# Altium schematic sheet Title.SchDoc: TITLE
size 420 x 297 mm; Address1: CryptUS; Address3: Pascal-Emmanuel Lachance; Address4: Benjamin Gélinas; SheetNumber: 1; SheetTotal: 12
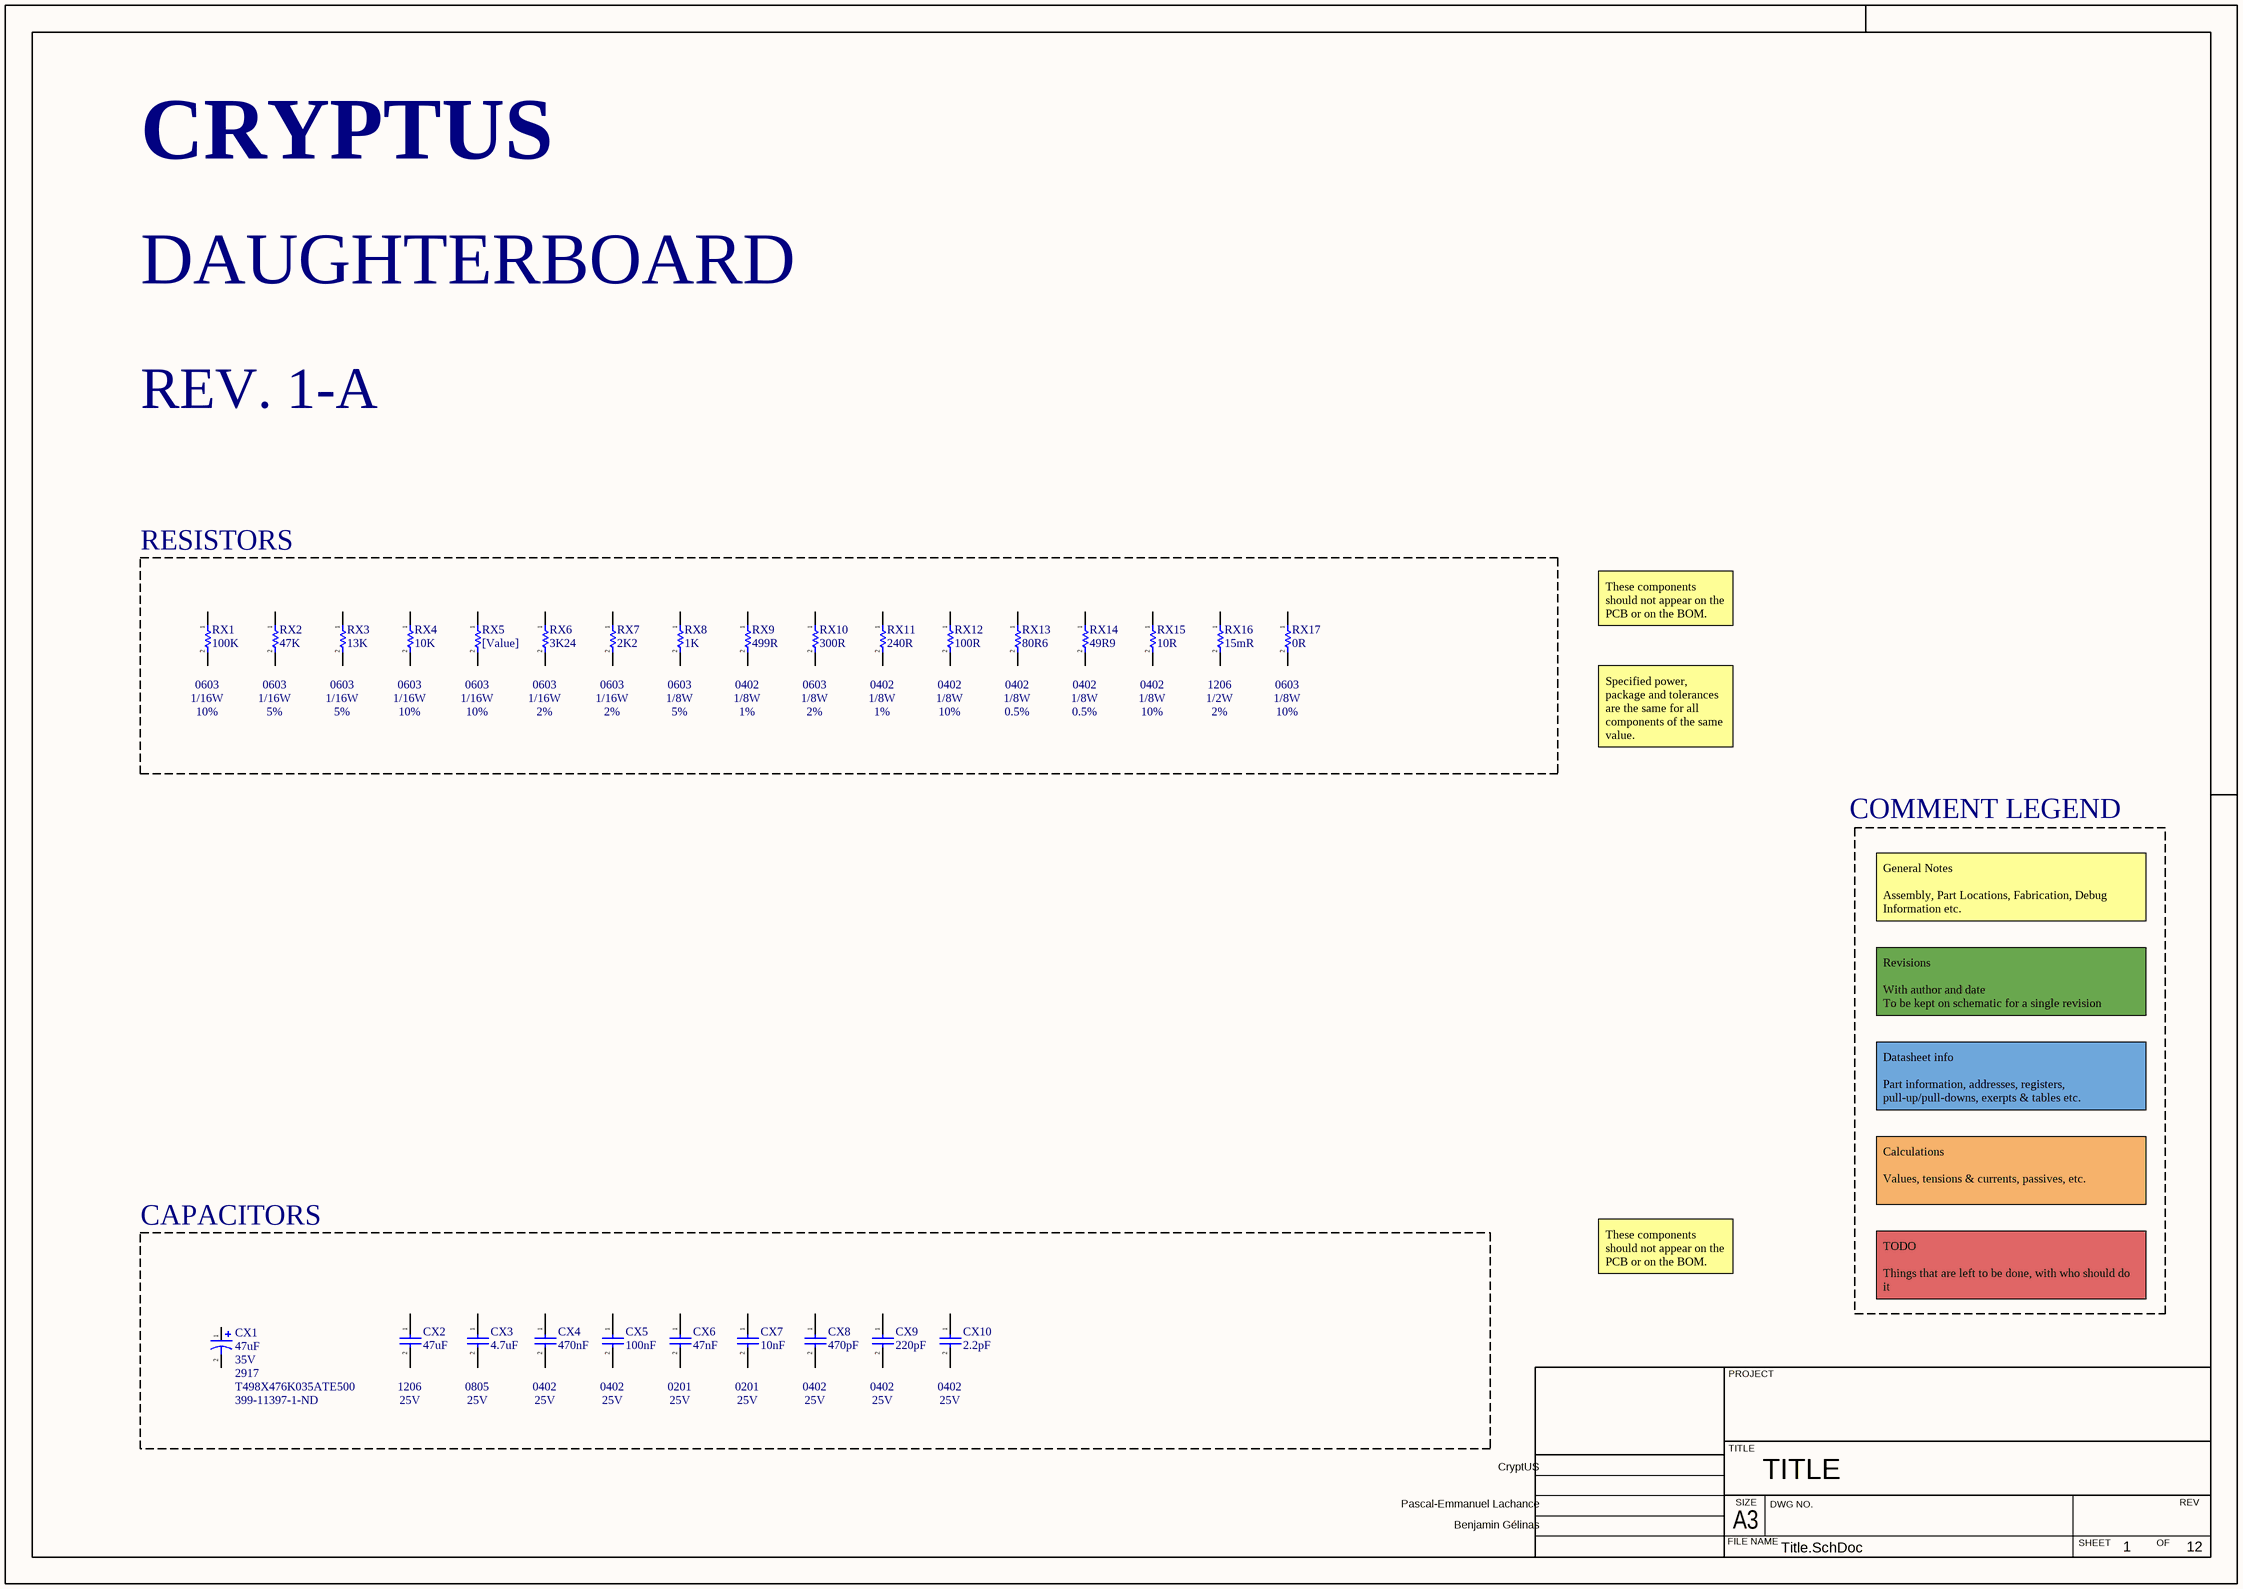
[diagram p0: Title.SchDoc]

## Parts
CX1  47uF  Part #: T498X476K035ATE500  Rated Voltage: 35V  Supplier Part Number 1: 399-11397-1-ND  Package: 2917  [CAP_2917_P]
CX2  47uF  [CAP_1206]
CX3  4.7uF  [CAP_0805]
CX4  470nF  [CAP_0402]
CX5  100nF  [CAP_0402]
CX6  47nF  [CAP_0201]
CX7  10nF  [CAP_0201]
CX8  470pF  [CAP_0402]
CX9  220pF  [CAP_0402]
CX10  2.2pF  [CAP_0402]
RX1  100K  [RES_0603]
RX2  47K  [RES_0603]
RX3  13K  [RES_0603]
RX4  10K  [RES_0603]
RX5  [Value]  [RES_0603]
RX6  3K24  [RES_0603]
RX7  2K2  [RES_0603]
RX8  1K  [RES_0603]
RX9  499R  [RES_0402]
RX10  300R  [RES_0603]
RX11  240R  [RES_0402]
RX12  100R  [RES_0402]
RX13  80R6  [RES_0402]
RX14  49R9  [RES_0402]
RX15  10R  [RES_0402]
RX16  15mR  [RES_1206]
RX17  0R  [RES_0603]

## Blocks framed on the sheet
RESISTORS: RX1-RX17
CAPACITORS: CX1-CX10

## Nets

Not connected (* = marked no-connect by the designer): CX1 1 2; CX2 1 2; CX3 1 2; CX4 1 2; CX5 1 2; CX6 1 2; CX7 1 2; CX8 1 2; CX9 1 2; CX10 1 2; RX1 1 2; RX2 1 2; RX3 1 2; RX4 1 2; RX5 1 2; RX6 1 2; RX7 1 2; RX8 1 2; RX9 1 2; RX10 1 2; RX11 1 2; RX12 1 2; RX13 1 2; RX14 1 2; RX15 1 2; RX16 1 2; RX17 1 2

## Notes on the sheet
- CRYPTUS
- DAUGHTERBOARD
- REV. 1-A
- These components should not appear on the PCB or on the BOM.
- (near RX1) 0603
- (near RX1) 1/16W
- 10%
- (near RX2) 0603
- (near RX2) 1/16W
- 5%
- (near RX3) 0603
- (near RX3) 1/16W
- (near RX4) 0603
- (near RX4) 1/16W
- (near RX5) 0603
- (near RX5) 1/16W
- (near RX6) 0603
- (near RX6) 1/16W
- 2%
- (near RX7) 0603
- (near RX7) 1/16W
- (near RX8) 0603
- (near RX8) 1/8W
- (near RX9) 0402
- (near RX9) 1/8W
- 1%
- (near RX10) 0603
- (near RX10) 1/8W
- (near RX11) 0402
- (near RX11) 1/8W
- (near RX12) 0402
- (near RX12) 1/8W
- (near RX13) 0402
- (near RX13) 1/8W
- 0.5%
- (near RX14) 0402
- (near RX14) 1/8W
- (near RX15) 0402
- (near RX15) 1/8W
- (near RX16) 1206
- (near RX16) 1/2W
- (near RX17) 0603
- (near RX17) 1/8W
- Specified power, package and tolerances are the same for all components of the same value.
- COMMENT LEGEND
- General Notes
  Assembly, Part Locations, Fabrication, Debug Information etc.
- Revisions
  With author and date
  To be kept on schematic for a single revision
- Datasheet info
  Part information, addresses, registers, pull-up/pull-downs, exerpts & tables etc.
- Calculations
  Values, tensions & currents, passives, etc.
- TODO
  Things that are left to be done, with who should do it
- (near CX2) 1206
- (near CX2) 25V
- (near CX3) 0805
- (near CX3) 25V
- (near CX4) 0402
- (near CX4) 25V
- (near CX5) 0402
- (near CX5) 25V
- (near CX6) 0201
- (near CX6) 25V
- (near CX7) 0201
- (near CX7) 25V
- (near CX8) 0402
- (near CX8) 25V
- (near CX9) 0402
- (near CX9) 25V
- (near CX10) 0402
- (near CX10) 25V
- PROJECT
- TITLE
- FILE NAME
- A3
- SIZE
- DWG NO.
- SHEET
- OF
- REV

## Library data of the parts
CX1 = CAP_T498X476K035ATE500: 47 µF Molded Tantalum Capacitors 35 V 2917 (7343 Metric) 500mOhm; Mfr: KEMET; Tolerance: 10%; Operating Temperature: -55C - 150C; Supplier 1: Digi-Key
CX2-CX10 = CAP_CER: Generic SMT Ceramic Capacitor; Voltage - Rated: 25V; Operating Temperature: *; Tolerance: *; Mfr: *; ComponentLink1Description: Digikey; ComponentLink1URL: [Digikey Link]; Digikey Part No: *; ComponentLink2Description: Datasheet; ComponentLink2URL: [Datasheet Link]
  CX2: Footprint: 1206
  CX3: Footprint: 0805
  CX4 CX5 CX8-CX10: Footprint: 0402
  CX6 CX7: Footprint: 0201
RX1 RX4 = RESISTOR: Power: 1/16W; Tolerance: 10%; Automotive: *; Operating Temperature: *; # Digikey: *; ComponentLink1Description: Digikey; ComponentLink1URL: *; # Manufacturer: *; Package / Case: 0603
RX2 RX8 = RESISTOR: Power: 1/8W; Tolerance: 5%; Automotive: *; Operating Temperature: *; # Digikey: *; ComponentLink1Description: Digikey; ComponentLink1URL: *; # Manufacturer: *; Package / Case: 0603
RX3 = RESISTOR: Power: 1/16W; Tolerance: 5%; Automotive: *; Operating Temperature: *; # Digikey: *; ComponentLink1Description: Digikey; ComponentLink1URL: *; # Manufacturer: *; Package / Case: 0603
RX5 = RESISTOR: Power: [Power]; Tolerance: [Tolerance]; Automotive: *; Operating Temperature: *; # Digikey: *; ComponentLink1Description: Digikey; ComponentLink1URL: *; # Manufacturer: *; Package / Case: [Package]
RX6 RX7 = RESISTOR: Power: 1/16W; Tolerance: 2%; Automotive: *; Operating Temperature: *; # Digikey: *; ComponentLink1Description: Digikey; ComponentLink1URL: *; # Manufacturer: *; Package / Case: 0603
RX9 RX11 = RESISTOR: Power: 1/8W; Tolerance: 1%; Automotive: *; Operating Temperature: *; # Digikey: *; ComponentLink1Description: Digikey; ComponentLink1URL: *; # Manufacturer: *; Package / Case: 0402
RX10 = RESISTOR: Power: 1/8W; Tolerance: 2%; Automotive: *; Operating Temperature: *; # Digikey: *; ComponentLink1Description: Digikey; ComponentLink1URL: *; # Manufacturer: *; Package / Case: 0603
RX12 RX15 RX17 = RESISTOR: Power: 1/8W; Tolerance: 10%; Automotive: *; Operating Temperature: *; # Digikey: *; ComponentLink1Description: Digikey; ComponentLink1URL: *; # Manufacturer: *
  RX12 RX15: Package / Case: 0402
  RX17: Package / Case: 0603
RX13 RX14 = RESISTOR: Power: 1/8W; Tolerance: 0.5%; Automotive: *; Operating Temperature: *; Package / Case: 0402; # Digikey: *; ComponentLink1Description: Digikey; ComponentLink1URL: *; # Manufacturer: *
RX16 = RESISTOR: Power: 1/2W; Tolerance: 2%; Automotive: *; Operating Temperature: *; # Digikey: *; ComponentLink1Description: Digikey; ComponentLink1URL: *; # Manufacturer: *; Package / Case: 1206